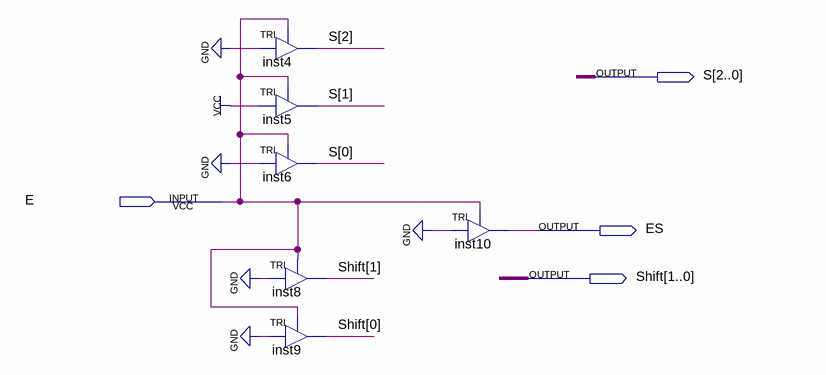
[diagram p0: schematic sheet]
// Quartus schematic RRI_Instruction_Design.bdf as structural Verilog: 6 symbols, 4 pins
module RRI_Instruction_Design (
  input  E,
  output [2:0] S,
  output ES,
  output [1:0] Shift
);

  TRI inst4 (.IN(1'b0), .OE(E), .OUT(S[2]));
  TRI inst5 (.IN(1'b1), .OE(E), .OUT(S[1]));
  TRI inst6 (.IN(1'b0), .OE(E), .OUT(S[0]));
  TRI inst8 (.IN(1'b0), .OE(E), .OUT(Shift[1]));
  TRI inst9 (.IN(1'b0), .OE(E), .OUT(Shift[0]));
  TRI inst10 (.IN(1'b0), .OE(E), .OUT(ES));
endmodule
